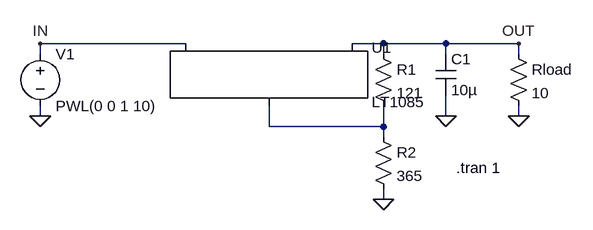
[diagram p0: schematic 1085.asc]
1085.asc, the LTspice schematic file:
Version 4
SHEET 1 2800 1520
WIRE 1552 896 1328 896
WIRE 1856 896 1808 896
WIRE 1952 896 1856 896
WIRE 2064 896 1952 896
WIRE 1328 912 1328 896
WIRE 1856 912 1856 896
WIRE 1952 912 1952 896
WIRE 2064 912 2064 896
WIRE 1328 1008 1328 992
WIRE 1952 1008 1952 976
WIRE 2064 1008 2064 992
WIRE 1680 1024 1680 992
WIRE 1856 1024 1856 992
WIRE 1856 1024 1680 1024
WIRE 1856 1040 1856 1024
WIRE 1856 1136 1856 1120
FLAG 2064 896 OUT
FLAG 1856 1136 0
FLAG 2064 1008 0
FLAG 1328 1008 0
FLAG 1952 1008 0
FLAG 1328 896 IN
SYMBOL RES 1840 896 R0
SYMATTR InstName R1
SYMATTR Value 121
SYMBOL RES 1840 1024 R0
SYMATTR InstName R2
SYMATTR Value 365
SYMBOL VOLTAGE 1328 896 R0
WINDOW 123 0 0 Left 2
SYMATTR InstName V1
SYMATTR Value PWL(0 0 1 10)
SYMATTR SpiceLine Rser=0.1
SYMBOL RES 2048 896 R0
SYMATTR InstName Rload
SYMATTR Value 10
SYMBOL cap 1936 912 R0
SYMATTR InstName C1
SYMATTR Value 10µ
SYMBOL PowerProducts\\LT1085 1680 896 R0
SYMATTR InstName U1
TEXT 1968 1088 Left 2 !.tran 1

The netlist it stands for:
* 1085.asc
R1 OUT N001 121
R2 N001 0 365
V1 IN 0 PWL(0 0 1 10) Rser=0.1
Rload OUT 0 10
C1 OUT 0 10µ
XU1 N001 OUT IN LT1085
.tran 1
.backanno
.end